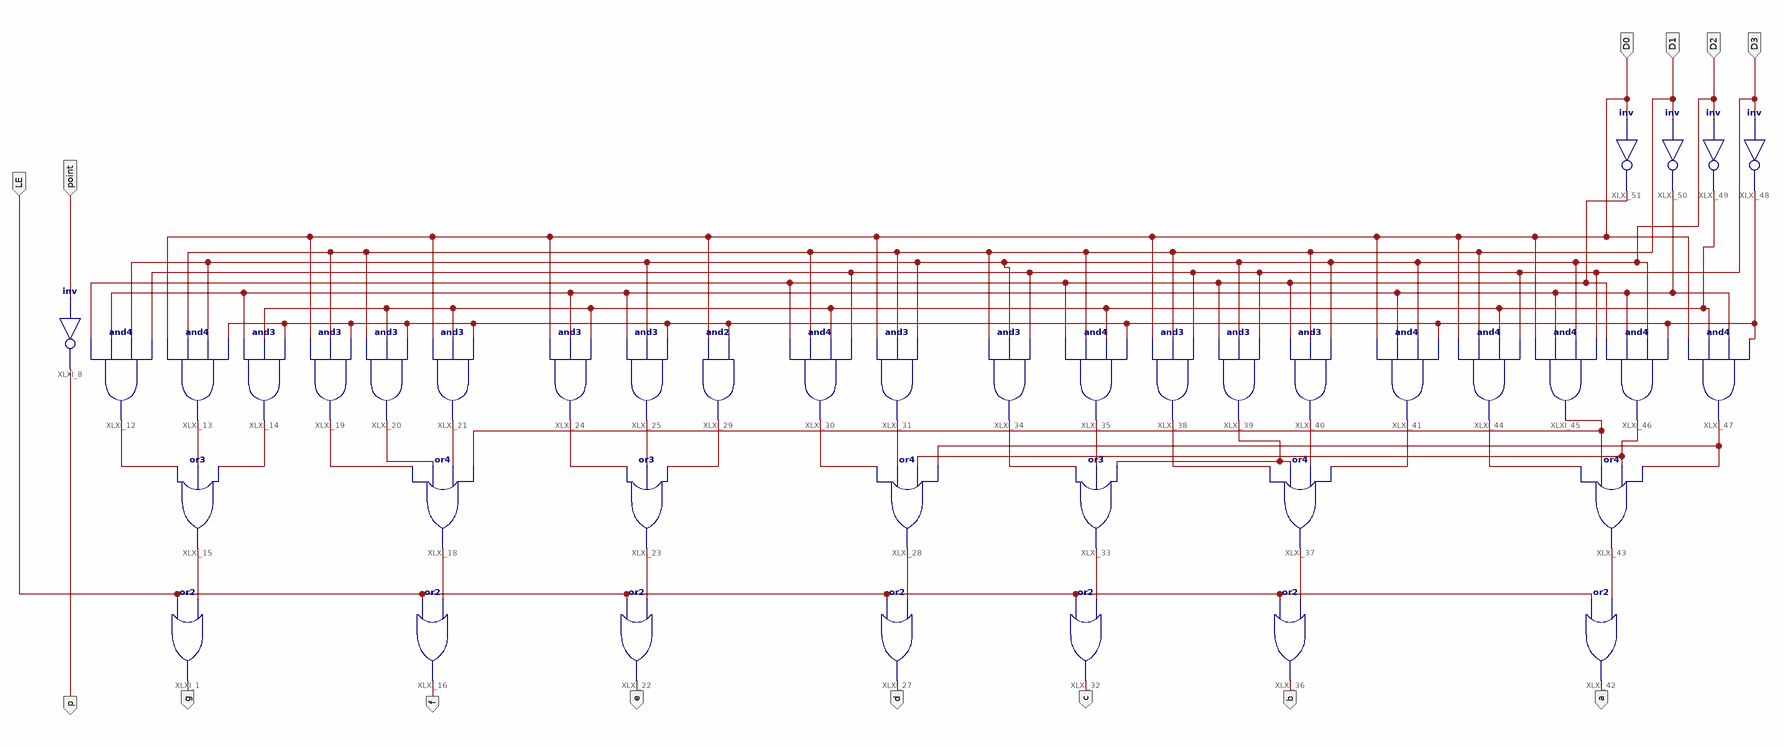
[diagram p0: schematic sheet 1]
// Xilinx ISE schematic MyMC14495.sch (kintex7) as structural Verilog: 40 symbols, 14 ports
module MyMC14495 (
  input  point,
  input  D0,
  input  D1,
  input  D2,
  input  D3,
  input  LE,
  output g,
  output p,
  output f,
  output e,
  output d,
  output c,
  output b,
  output a
);

  wire XLXN_18, XLXN_22, XLXN_23, XLXN_32, XLXN_37, XLXN_44, XLXN_45, XLXN_46, XLXN_48, XLXN_51, XLXN_52,
       XLXN_53, XLXN_55, XLXN_56, XLXN_61, XLXN_64, XLXN_65, XLXN_66, XLXN_68, XLXN_73, XLXN_75, XLXN_76,
       XLXN_79, XLXN_82, XLXN_83, XLXN_84, XLXN_99, XLXN_100, XLXN_113, XLXN_121, XLXN_122, XLXN_133;

  or XLXI_1 (g, LE, XLXN_32);
  not XLXI_8 (p, point);
  and XLXI_12 (XLXN_18, XLXN_133, XLXN_122, D2, D3);
  and XLXI_13 (XLXN_22, D0, D1, D2, XLXN_113);
  and XLXI_14 (XLXN_23, XLXN_122, XLXN_121, XLXN_113);
  or XLXI_15 (XLXN_32, XLXN_18, XLXN_22, XLXN_23);
  or XLXI_16 (f, LE, XLXN_37);
  or XLXI_18 (XLXN_37, XLXN_44, XLXN_45, XLXN_46, XLXN_84);
  and XLXI_19 (XLXN_44, D0, D1, XLXN_113);
  and XLXI_20 (XLXN_45, D1, XLXN_121, XLXN_113);
  and XLXI_21 (XLXN_46, D0, XLXN_121, XLXN_113);
  or XLXI_22 (e, LE, XLXN_48);
  or XLXI_23 (XLXN_48, XLXN_51, XLXN_52, XLXN_53);
  and XLXI_24 (XLXN_51, D0, XLXN_122, XLXN_121);
  and XLXI_25 (XLXN_52, XLXN_122, D2, XLXN_113);
  or XLXI_27 (d, LE, XLXN_55);
  or XLXI_28 (XLXN_55, XLXN_56, XLXN_61, XLXN_99, XLXN_100);
  and XLXI_29 (XLXN_53, D0, XLXN_113);
  and XLXI_30 (XLXN_56, XLXN_133, D1, XLXN_121, D3);
  and XLXI_31 (XLXN_61, D0, D1, D2);
  or XLXI_32 (c, LE, XLXN_64);
  or XLXI_33 (XLXN_64, XLXN_65, XLXN_66, XLXN_73);
  and XLXI_34 (XLXN_65, D1, D2, D3);
  and XLXI_35 (XLXN_66, XLXN_133, D1, XLXN_121, XLXN_113);
  or XLXI_36 (b, LE, XLXN_68);
  or XLXI_37 (XLXN_68, XLXN_75, XLXN_73, XLXN_76, XLXN_79);
  and XLXI_38 (XLXN_75, D0, D1, D3);
  and XLXI_39 (XLXN_73, XLXN_133, D2, D3);
  and XLXI_40 (XLXN_76, XLXN_133, D1, D2);
  and XLXI_41 (XLXN_79, D0, XLXN_122, D2, XLXN_113);
  or XLXI_42 (a, LE, XLXN_82);
  or XLXI_43 (XLXN_82, XLXN_83, XLXN_84, XLXN_99, XLXN_100);
  and XLXI_44 (XLXN_83, D0, D1, XLXN_121, D3);
  and XLXI_45 (XLXN_84, D0, XLXN_122, D2, D3);
  and XLXI_46 (XLXN_99, XLXN_133, XLXN_122, D2, XLXN_113);
  and XLXI_47 (XLXN_100, D0, XLXN_121, XLXN_122, XLXN_113);
  not XLXI_48 (XLXN_113, D3);
  not XLXI_49 (XLXN_121, D2);
  not XLXI_50 (XLXN_122, D1);
  not XLXI_51 (XLXN_133, D0);
endmodule
